# Altium project Science_Sensor_A_EM_CG - Copy.PrjPcb
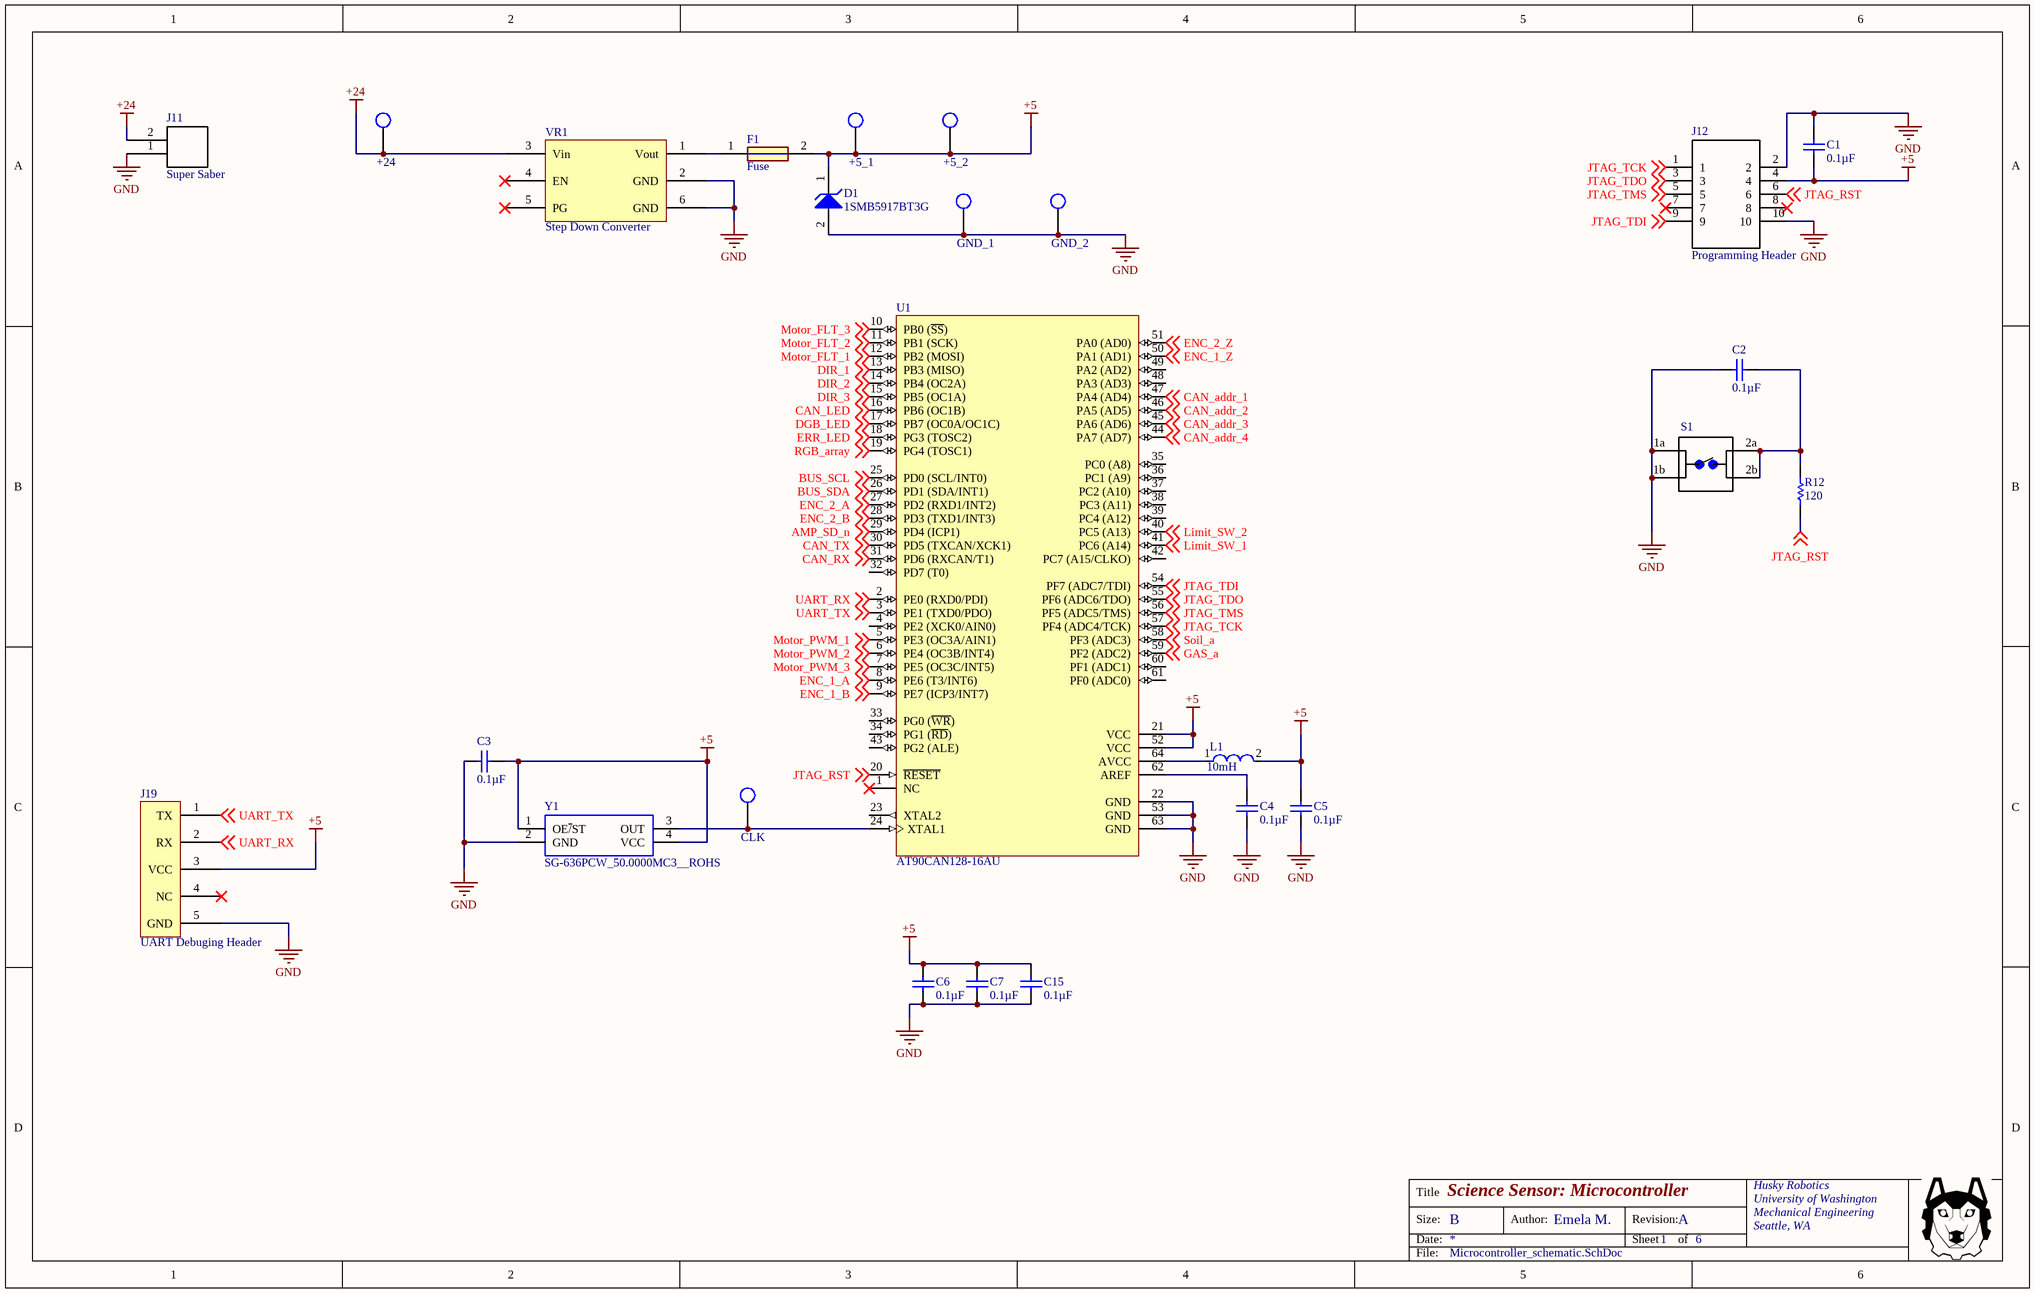
[diagram p0: Microcontroller_schematic.SchDoc]
CAGE_CODE: ?????; CONTRACT_NUMBER: <CONTRACT NO>; DOC_NO_ASSY_DWG: <ASSY DWG NO>; DOC_NO_BOM: <BOM DOC NO>; DOC_NO_FAB_DWG: <FAB DWG NO>; DOC_NO_SCH_DWG: <SCH DWG NO>; PCB_2_DEC_TOL: +/-.01; PCB_3_DEC_TOL: +/-.010; PCB_ANG_TOL: +/-1/2; PCB_ASSEMBLY_NO: <PCB ASSY NO>; PCB_CHECKER: - -----; PCB_CHECKER_APP_DATE: --/--/----; PCB_DESIGNER: - -----; PCB_DESIGNER_APP_DATE: --/--/----; PCB_DWG_NO: <PCB DWG NO>; PCB_ENGINEER: - -----; PCB_ENGINEER_APP_DATE: --/--/----; PCB_PART_NUMBER: <PCB PN>; PCB_REV: A; SCH_REV: A
6 sheets, 133 parts. Net scope: global (net labels, ports and power ports of the same name join across sheets).
Board file: Science_Sensor_A_EM_CG_PCB.PcbDoc
Sheets:
  Microcontroller_schematic.SchDoc
  Motors_and_Servos.SchDoc
  CAN.SchDoc
  LEDs.SchDoc
  Sensors.SchDoc
  Meow.SchDoc

## Sheet Microcontroller_schematic.SchDoc: Science Sensor: Microcontroller
size B; ENG_APP_DATE: --/--/--; DSN_APP_DATE: --/--/--; CHK_APP_DATE: --/--/--; Author: Emela M.; Organization: Husky Robotics; Address1: University of Washington; Address2: Mechanical Engineering; Address3: Seattle, WA; Address4: Australia 2086; Revision: A; SheetNumber: 1; SheetTotal: 6

### Parts
+5_1  Test Point  [Test Point Through-hole]  (value not drawn)
+5_2  Test Point  [Test Point Through-hole]  (value not drawn)
+24  Test Point  [Test Point Through-hole]  (value not drawn)
C1  Capacitance: 0.1µF  [Cap 0805]  (hidden comment: Capacitor 0805)
C2  Capacitance: 0.1µF  [Cap 0805]  (hidden comment: Capacitor 0805)
C3  Capacitance: 0.1µF  [Cap 0805]  (hidden comment: Capacitor 0805)
C4  Capacitance: 0.1µF  [Cap 0805]  (hidden comment: Capacitor 0805)
C5  Capacitance: 0.1µF  [Cap 0805]  (hidden comment: Capacitor 0805)
C6  Capacitance: 0.1µF  [Cap 0805]  (hidden comment: Capacitor 0805)
C7  Capacitance: 0.1µF  [Cap 0805]  (hidden comment: Capacitor 0805)
C15  Capacitance: 0.1µF  [Cap 0805]  (hidden comment: Capacitor 0805)
CLK  Test Point  [Test Point Through-hole]  (value not drawn)
D1  1SMB5917BT3G  [ONSC-SMB-2-403A-03_H_V]
F1  Fuse  [Fuse_Through_Hole - duplicate]
GND_1  Test Point  [Test Point Through-hole]  (value not drawn)
GND_2  Test Point  [Test Point Through-hole]  (value not drawn)
J11  Super Saber  [SuperSaber R/A]
J12  Programming Header  [programming3D]
J19  UART Debuging Header  [UART Debugging Header]
L1  10mH  [FP-CV201210-R10K-MFG]
R12  value 120  [RESC0805(2012)_N]  (hidden comment: Resistor 0805)
S1  1825910-7  [Switch 6mm 24V (NO)]  (value not drawn)
U1  AT90CAN128-16AU  [64A_M]
VR1  Step Down Converter  [24V-5V Converter]
Y1  SG-636PCW_50.0000MC3__ROHS  [SG-636_3D]

### Nets
+5: +5_1.1 +5_2.1 C1.1 C3.2 C5.2 C6.2 C7.2 C15.2 D1.1(K) F1.2 J12.4 J19.3(VCC) L1.2 U1.21(VCC) U1.52(VCC) Y1.1(OE~{/}ST) Y1.4(VCC)
+24: +24.1 J11.2 VR1.3(Vin)
GND: C1.2 C2.1 C3.1 C4.1 C5.1 C6.1 C7.1 C15.1 D1.2(A) GND_1.1 GND_2.1 J11.1 J12.2 J12.10 J19.5(GND) S1.1a S1.1b U1.22(GND) U1.53(GND) U1.63(GND) VR1.2(GND) VR1.6(GND) Y1.2(GND)
AMP_SD_n: U1.29(PD4_(ICP1)) ; off-sheet AMP_SD_n
BUS_SCL: U1.25(PD0_(SCL/INT0)) ; off-sheet BUS_SCL
BUS_SDA: U1.26(PD1_(SDA/INT1)) ; off-sheet BUS_SDA
CAN_addr_1: U1.47(PA4_(AD4)) ; off-sheet CAN_addr_1
CAN_addr_2: U1.46(PA5_(AD5)) ; off-sheet CAN_addr_2
CAN_addr_3: U1.45(PA6_(AD6)) ; off-sheet CAN_addr_3
CAN_addr_4: U1.44(PA7_(AD7)) ; off-sheet CAN_addr_4
CAN_LED: U1.16(PB6_(OC1B)) ; off-sheet CAN_LED
CAN_RX: U1.31(PD6_(RXCAN/T1)) ; off-sheet CAN_RX
CAN_TX: U1.30(PD5_(TXCAN/XCK1)) ; off-sheet CAN_TX
DGB_LED: U1.17(PB7_(OC0A/OC1C)) ; off-sheet DGB_LED
DIR_1: U1.13(PB3_(MISO)) ; off-sheet DIR_1
DIR_2: U1.14(PB4_(OC2A)) ; off-sheet DIR_2
DIR_3: U1.15(PB5_(OC1A)) ; off-sheet DIR_3
ENC_1_A: U1.8(PE6_(T3/INT6)) ; off-sheet ENC_1_A
ENC_1_B: U1.9(PE7_(ICP3/INT7)) ; off-sheet ENC_1_B
ENC_1_Z: U1.50(PA1_(AD1)) ; off-sheet ENC_1_Z
ENC_2_A: U1.27(PD2_(RXD1/INT2)) ; off-sheet ENC_2_A
ENC_2_B: U1.28(PD3_(TXD1/INT3)) ; off-sheet ENC_2_B
ENC_2_Z: U1.51(PA0_(AD0)) ; off-sheet ENC_2_Z
ERR_LED: U1.18(PG3_(TOSC2)) ; off-sheet ERR_LED
GAS_a: U1.59(PF2_(ADC2)) ; off-sheet GAS_a
JTAG_RST: J12.6 R12.1 U1.20(~{RESET}) ; off-sheet JTAG_RST
JTAG_TCK: J12.1 U1.57(PF4_(ADC4/TCK)) ; off-sheet JTAG_TCK
JTAG_TDI: J12.9 U1.54(PF7_(ADC7/TDI)) ; off-sheet JTAG_TDI
JTAG_TDO: J12.3 U1.55(PF6_(ADC6/TDO)) ; off-sheet JTAG_TDO
JTAG_TMS: J12.5 U1.56(PF5_(ADC5/TMS)) ; off-sheet JTAG_TMS
Limit_SW_1: U1.41(PC6_(A14)) ; off-sheet Limit_SW_1
Limit_SW_2: U1.40(PC5_(A13)) ; off-sheet Limit_SW_2
Motor_FLT_1: U1.12(PB2_(MOSI)) ; off-sheet Motor_FLT_1
Motor_FLT_2: U1.11(PB1_(SCK)) ; off-sheet Motor_FLT_2
Motor_FLT_3: U1.10(PB0_(~{SS})) ; off-sheet Motor_FLT_3
Motor_PWM_1: U1.5(PE3_(OC3A/AIN1)) ; off-sheet Motor_PWM_1
Motor_PWM_2: U1.6(PE4_(OC3B/INT4)) ; off-sheet Motor_PWM_2
Motor_PWM_3: U1.7(PE5_(OC3C/INT5)) ; off-sheet Motor_PWM_3
RGB_array: U1.19(PG4_(TOSC1)) ; off-sheet RGB_array
Soil_a: U1.58(PF3_(ADC3)) ; off-sheet Soil_a
UART_RX: J19.2(RX) U1.2(PE0_(RXD0/PDI)) ; off-sheet UART_RX
UART_TX: J19.1(TX) U1.3(PE1_(TXD0/PDO)) ; off-sheet UART_TX
NetC2_2: C2.2 R12.2 S1.2a S1.2b
NetC4_2: C4.2 U1.62(AREF)
NetCLK_1: CLK.1 U1.24(XTAL1) Y1.3(OUT)
NetF1_1: F1.1 VR1.1(Vout)
NetL1_1: L1.1 U1.64(AVCC)

Not connected (* = marked no-connect by the designer): J12 7* 8*; J19 4(NC)*; U1 1(NC)* 4(PE2_(XCK0/AIN0)) 23(XTAL2) 32(PD7_(T0)) 33(PG0_(~{WR})) 34(PG1_(~{RD})) 35(PC0_(A8)) 36(PC1_(A9)) 37(PC2_(A10)) 38(PC3_(A11)) 39(PC4_(A12)) 42(PC7_(A15/CLKO)) 43(PG2_(ALE)) 48(PA3_(AD3)) 49(PA2_(AD2)) 60(PF1_(ADC1)) 61(PF0_(ADC0)); VR1 4(EN)* 5(PG)*

### Notes on the sheet
- Title
- Size:
- Date:
- B
- Author:
- Revision:
- Sheet
- of
- File:

### Library data of the parts
C1-C7 C15 = Capacitor 0805: Standard Capacitor; Manufacturer: AVX; Tolerance (%): ±10%; Dielectric: X5R; Rated Voltage: 10V; Datasheet Version: 05/2016; Manufacturer URL: http://www.avx.com/; Package Description: 2-Pin Surface Mount Device, Body 2.01 x 1.25 mm; Mounting Technology: SurfaceMount; Case Size/Dimension: 0805; Package Reference: 0805; Datasheet URL: http://datasheets.avx.com/cx5r.pdf
D1 = Zener Diode 5.1V: 3 W Zener Voltage Regulator, 2-Pin SMB, Pb-Free, Tape and Reel; Manufacturer: On Semiconductor; VZ Typ (V): 4.7; RoHS: Pb-Free; ComponentLink1Description: Manufacturer URL; ComponentLink2URL: http://www.onsemi.com/pub_link/Collateral/1SMB5913BT3-D.PDF; Mounting Technology: Surface Mount; PackageVersion: Rev. H, 05/2011; DatasheetVersion: Rev. 8; Packing: Tape and Reel; PartNumber: 1SMB5917BT3G; ComponentLink2Description: Datasheet; ComponentLink3Description: Package Specification; PackageReference: SMB-2-403A-03_H; ComponentLink1URL: http://www.onsemi.com/; PackageDescription: 2-Pin Small Molded Package, J-Bend Lead, Body 4.33 x 3.625 mm; ComponentLink3URL: http://www.onsemi.com/pub_link/Collateral/1SMB5913BT3-D.PDF
L1 = CMP-07248-000019-1: FIXED IND 100NH 250MA 300 MOHM; Manufacturer: Bourns; Manufacturer Part Number: CV201210-R10K; Value: 0.1uH; Core Material: Ferrite; Tolerance: 10%; Test Frequency: 25MHz; Self Resonant Frequency: 235MHz; Q Factor: 20; Series Resistance: 300mΩ; Shielding: true; ComponentLink2Description: Datasheet; Ipc Land Pattern Name: CAPC200125X85; ComponentLink2URL: https://www.bourns.com/docs/product-datasheets/cv201210.pdf?sfvrsn=f7844854_5; RoHS: TRUE; Device Class L3: Fixed Inductors; Octopart: https://octopart.com/cv201210-r10k-bourns-2076708; Lead Free: Yes; Device Class L2: Inductors; Temperature: -55°C to +125°C; Height: 1.05mm; Automotive: No; Inductance: 0.1uH; Temperature Range High: +125°C; Category: Ind; Package: CV201210-R10K; Digikey Description: FIXED IND 100NH 250MA 300 MOHM; Device Class L1: Passive Components; Rms Current: 250mA; Mouser Description: Fixed Inductors .1uH 10% MULTI LAYER; Temperature Range Low: -55°C; Composition: Multilayer
R12 = Resistor 0805: Generic 0805 Resistor; Tolerance: 5 %; Case-Metric: 2012; Case-EIA: 0805; Power: 0.125 W; Technology: SMT
S1 = Switch 6mm 24V (NO): FSM4JAH=6MM TACT SWITCH, HIGH TEMP; MF: TE Connectivity; Contact_Current_Rating: 50 mA; Configuration_Pole-Throw: Single Pole - Single Throw; Package: None; Digi-Key_Part_Number: 450-1804-ND; Digi-Key_Purchase_URL: https://www.digikey.com/product-detail/en/te-connectivity-alcoswitch-switches/1825910-7/450-1804-ND/1731414?utm_source=snapeda&utm_medium=aggregator&utm_campaign=symbol; MP: 1825910-7; SnapEDA_Link: https://www.snapeda.com/parts/1825910-7/TE%20Connectivity%20ALCOSWITCH%20Switches/view-part/?ref=snap; EU_RoHS_Compliance: Compliant; TE_purchase_URL: https://www.te.com/usa-en/product-1825910-7.html?te_bu=Cor&te_type=disp&te_campaign=seda_glo_cor-seda-global-disp-prtnr-fy19-seda-model-bom-cta_sma-317_1&elqCampaignId=32493; Value: *
U1 = CMP-0096-00104-2: 8-bit AVR Microcontroller, 128KB Flash and CAN Controller, 53 GPIO pins, Industrial Grade (-40° to +85°C), 64-pin LQFP, Green; PackageVersion: revC, Oct-2010; ComponentLink1Description: Manufacturer URL; ComponentLink3Description: AT90CAN32/64/128 Summary; ComponentLink2Description: AT90CAN32/64/128 Datasheet; Code_JEDEC: MS-026-AEB; DatasheetVersion: revH, Aug-2008; ComponentLink2URL: http://www.atmel.com/dyn/resources/prod_documents/doc7679.pdf; ComponentLink3URL: http://www.atmel.com/dyn/resources/prod_documents/7679S.pdf; ComponentLink1URL: http://www.atmel.com/; RevisionNote: PackageVersion updated. URLs added.; PackageReference: 64A; PackageDescription: 64-Pin Plastic Thin Profile Quad Flat Pack, 14 x 14 x 1.0 mm Body, 0.8 mm Pitch (TQFP)
VR1 = 24V-5V Pololu 2858
Y1 = Oscilator: Standard Clock Oscillators; Manufacturer_Name: Epson Timing; Manufacturer_Part_Number: SG-636PCW 50.0000MC3: ROHS; RS Part Number: *; RS Price/Stock: *; Arrow Part Number: SG-636PCW 50.0000MC3: ROHS; Arrow Price/Stock: *; Datasheet Link: http://www.mouser.com/ds/2/137/G-636PCE_en-1003252.pdf

## Sheet Motors_and_Servos.SchDoc: Science Sensor: Motors & Servos
size Letter; Author: Emela M.; Organization: Husky Robotics; Address1: University of Washington; Address2: Mechanical Engineering; Address3: Seattle, WA; Revision: A; SheetNumber: 2; SheetTotal: 6
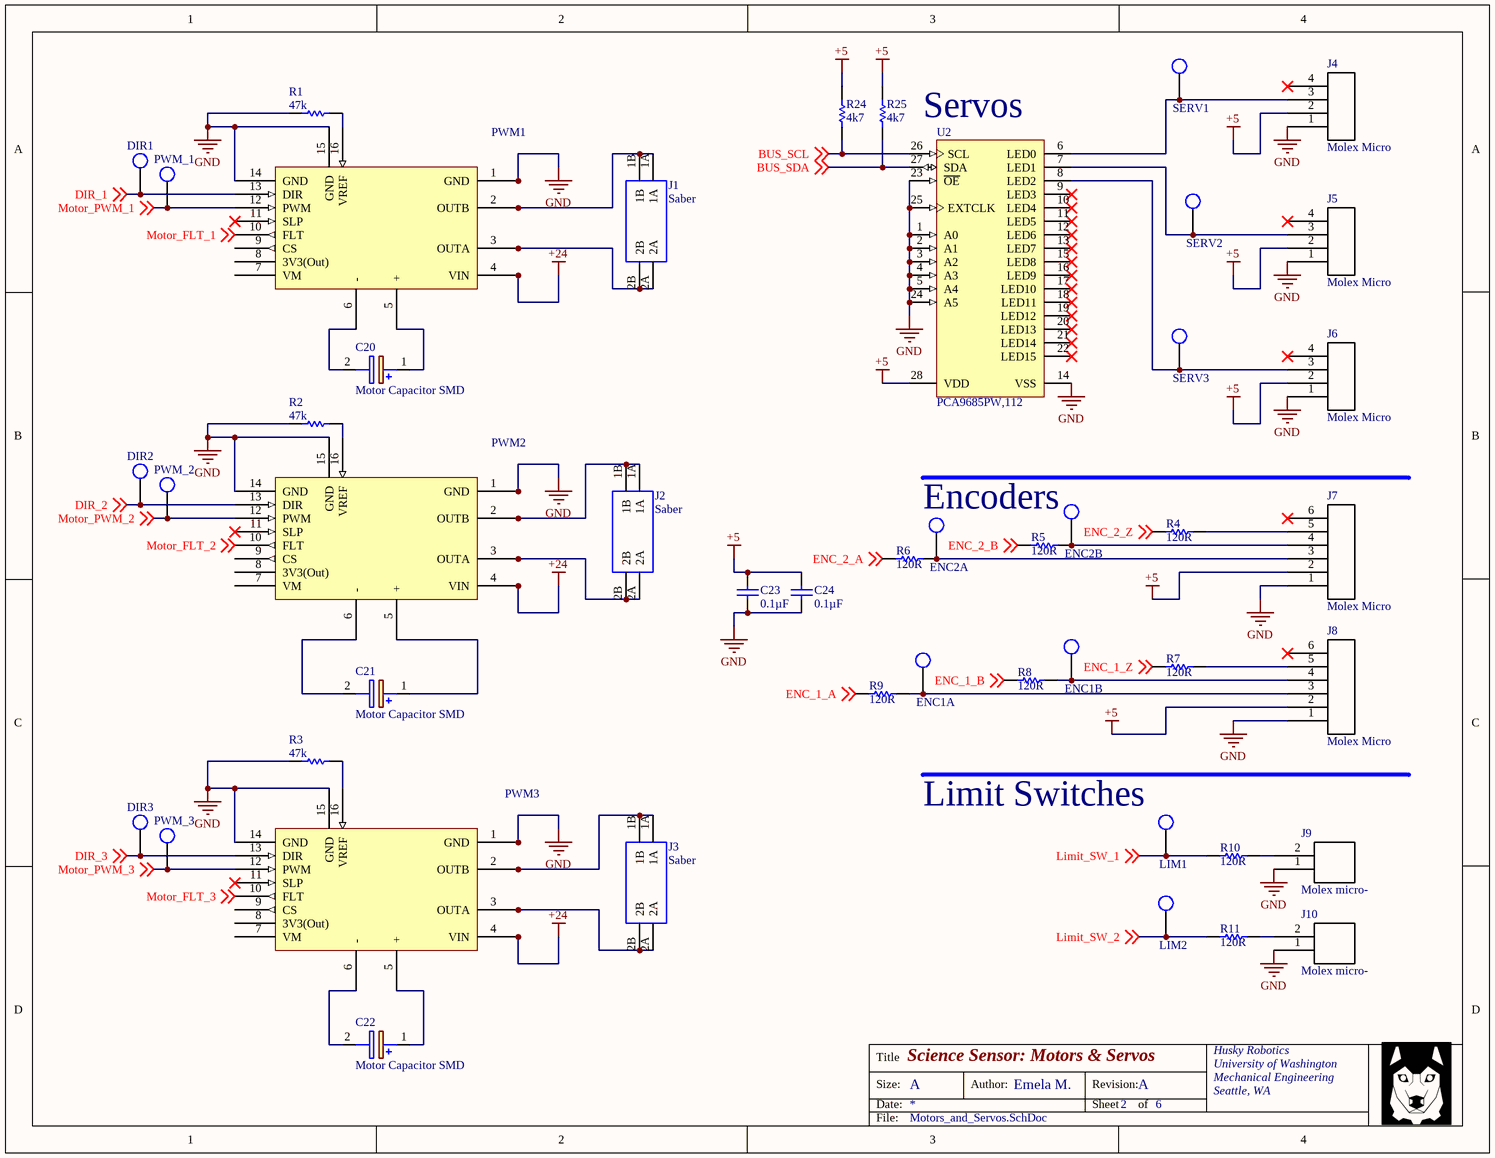
[diagram p1: Motors_and_Servos.SchDoc]

### Parts
C20  Motor Capacitor SMD  [CAP_SMD_CAN]
C21  Motor Capacitor SMD  [CAP_SMD_CAN]
C22  Motor Capacitor SMD  [CAP_SMD_CAN]
C23  Capacitance: 0.1µF  [Cap 0805]  (hidden comment: Capacitor 0805)
C24  Capacitance: 0.1µF  [Cap 0805]  (hidden comment: Capacitor 0805)
DIR1  Test Point  [Test Point Through-hole]  (value not drawn)
DIR2  Test Point  [Test Point Through-hole]  (value not drawn)
DIR3  Test Point  [Test Point Through-hole]  (value not drawn)
ENC1A  Test Point  [Test Point Through-hole]  (value not drawn)
ENC1B  Test Point  [Test Point Through-hole]  (value not drawn)
ENC2A  Test Point  [Test Point Through-hole]  (value not drawn)
ENC2B  Test Point  [Test Point Through-hole]  (value not drawn)
J1  Saber  [SABER R/A]
J2  Saber  [SABER R/A]
J3  Saber  [SABER R/A]
J4  Molex Micro  [MICROFIT R/A 4 PIN]
J5  Molex Micro  [MICROFIT R/A 4 PIN]
J6  Molex Micro  [MICROFIT R/A 4 PIN]
J7  Molex Micro  [MICROFIT R/A 6 PIN]
J8  Molex Micro  [MICROFIT R/A 6 PIN]
J9  Molex micro-  [microfit R/A 2 pin]
J10  Molex micro-  [microfit R/A 2 pin]
LIM1  Test Point  [Test Point Through-hole]  (value not drawn)
LIM2  Test Point  [Test Point Through-hole]  (value not drawn)
PWM1  6.5V - 40V  [Pololu_G2_Driver_24v21]  (value not drawn)
PWM2  6.5V - 40V  [Pololu_G2_Driver_24v21]  (value not drawn)
PWM3  6.5V - 40V  [Pololu_G2_Driver_24v21]  (value not drawn)
PWM_1  Test Point  [Test Point Through-hole]  (value not drawn)
PWM_2  Test Point  [Test Point Through-hole]  (value not drawn)
PWM_3  Test Point  [Test Point Through-hole]  (value not drawn)
R1  value 47k  [RESC0805(2012)_N]  (hidden comment: Resistor 0805)
R2  value 47k  [RESC0805(2012)_N]  (hidden comment: Resistor 0805)
R3  value 47k  [RESC0805(2012)_N]  (hidden comment: Resistor 0805)
R4  value 120R  [RESC0805(2012)_N]  (hidden comment: Resistor 0805)
R5  value 120R  [RESC0805(2012)_N]  (hidden comment: Resistor 0805)
R6  value 120R  [RESC0805(2012)_N]  (hidden comment: Resistor 0805)
R7  value 120R  [RESC0805(2012)_N]  (hidden comment: Resistor 0805)
R8  value 120R  [RESC0805(2012)_N]  (hidden comment: Resistor 0805)
R9  value 120R  [RESC0805(2012)_N]  (hidden comment: Resistor 0805)
R10  value 120R  [RESC0805(2012)_N]  (hidden comment: Resistor 0805)
R11  value 120R  [RESC0805(2012)_N]  (hidden comment: Resistor 0805)
R24  value 4k7  [RESC0805(2012)_N]  (hidden comment: Resistor 0805)
R25  value 4k7  [RESC0805(2012)_N]  (hidden comment: Resistor 0805)
SERV1  Test Point  [Test Point Through-hole]  (value not drawn)
SERV2  Test Point  [Test Point Through-hole]  (value not drawn)
SERV3  Test Point  [Test Point Through-hole]  (value not drawn)
U2  PCA9685PW,112  [SOT361-1_V]

### Nets
+5: C23.2 C24.2 J4.2 J5.2 J6.2 J7.2 J8.2 R24.2 R25.2 U2.28(VDD)
+24: PWM1.4(VIN) PWM1.4a(VIN) PWM1.4b(VIN) PWM2.4(VIN) PWM2.4a(VIN) PWM2.4b(VIN) PWM3.4(VIN) PWM3.4a(VIN) PWM3.4b(VIN)
GND: C23.1 C24.1 J4.1 J5.1 J6.1 J7.1 J8.1 J9.1 J10.1 PWM1.1(GND) PWM1.1a(GND) PWM1.1b(GND) PWM1.14(GND) PWM1.15(GND) PWM2.1(GND) PWM2.1a(GND) PWM2.1b(GND) PWM2.14(GND) PWM2.15(GND) PWM3.1(GND) PWM3.1a(GND) PWM3.1b(GND) PWM3.14(GND) PWM3.15(GND) R1.2 R2.2 R3.2 U2.1(A0) U2.2(A1) U2.3(A2) U2.4(A3) U2.5(A4) U2.14(VSS) U2.23(~{OE}) U2.24(A5) U2.25(EXTCLK)
BUS_SCL: R24.1 U2.26(SCL) ; off-sheet BUS_SCL
BUS_SDA: R25.1 U2.27(SDA) ; off-sheet BUS_SDA
DIR_1: DIR1.1 PWM1.13(DIR) ; off-sheet DIR_1
DIR_2: DIR2.1 PWM2.13(DIR) ; off-sheet DIR_2
DIR_3: DIR3.1 PWM3.13(DIR) ; off-sheet DIR_3
ENC_1_A: R9.1 ; off-sheet ENC_1_A
ENC_1_B: R8.1 ; off-sheet ENC_1_B
ENC_1_Z: R7.1 ; off-sheet ENC_1_Z
ENC_2_A: R6.1 ; off-sheet ENC_2_A
ENC_2_B: R5.1 ; off-sheet ENC_2_B
ENC_2_Z: R4.1 ; off-sheet ENC_2_Z
Limit_SW_1: LIM1.1 R10.1 ; off-sheet Limit_SW_1
Limit_SW_2: LIM2.1 R11.1 ; off-sheet Limit_SW_2
Motor_FLT_1: PWM1.10(FLT) ; off-sheet Motor_FLT_1
Motor_FLT_2: PWM2.10(FLT) ; off-sheet Motor_FLT_2
Motor_FLT_3: PWM3.10(FLT) ; off-sheet Motor_FLT_3
Motor_PWM_1: PWM1.12(PWM) PWM_1.1 ; off-sheet Motor_PWM_1
Motor_PWM_2: PWM2.12(PWM) PWM_2.1 ; off-sheet Motor_PWM_2
Motor_PWM_3: PWM3.12(PWM) PWM_3.1 ; off-sheet Motor_PWM_3
NetC20_1: C20.1(+) PWM1.5(+)
NetC20_2: C20.2(-) PWM1.6(-)
NetC21_1: C21.1(+) PWM2.5(+)
NetC21_2: C21.2(-) PWM2.6(-)
NetC22_1: C22.1(+) PWM3.5(+)
NetC22_2: C22.2(-) PWM3.6(-)
NetENC1A_1: ENC1A.1 J8.3 R9.2
NetENC1B_1: ENC1B.1 J8.4 R8.2
NetENC2A_1: ENC2A.1 J7.3 R6.2
NetENC2B_1: ENC2B.1 J7.4 R5.2
NetJ1_1A: J1.1A J1.1B PWM1.2(OUTB) PWM1.2a(OUTB) PWM1.2b(OUTB)
NetJ1_2A: J1.2A J1.2B PWM1.3(OUTA) PWM1.3a(OUTA) PWM1.3b(OUTA)
NetJ2_1A: J2.1A J2.1B PWM2.2(OUTB) PWM2.2a(OUTB) PWM2.2b(OUTB)
NetJ2_2A: J2.2A J2.2B PWM2.3(OUTA) PWM2.3a(OUTA) PWM2.3b(OUTA)
NetJ3_1A: J3.1A J3.1B PWM3.2(OUTB) PWM3.2a(OUTB) PWM3.2b(OUTB)
NetJ3_2A: J3.2A J3.2B PWM3.3(OUTA) PWM3.3a(OUTA) PWM3.3b(OUTA)
NetJ4_3: J4.3 SERV1.1 U2.6(LED0)
NetJ5_3: J5.3 SERV2.1 U2.7(LED1)
NetJ6_3: J6.3 SERV3.1 U2.8(LED2)
NetJ7_5: J7.5 R4.2
NetJ8_5: J8.5 R7.2
NetJ9_2: J9.2 R10.2
NetJ10_2: J10.2 R11.2
NetPWM1_16: PWM1.16(VREF) R1.1
NetPWM2_16: PWM2.16(VREF) R2.1
NetPWM3_16: PWM3.16(VREF) R3.1

Not connected (* = marked no-connect by the designer): J4 4*; J5 4*; J6 4*; J7 6*; J8 6*; PWM1 7(VM) 8(3V3(Out)) 9(CS) 11(SLP)*; PWM2 7(VM) 8(3V3(Out)) 9(CS) 11(SLP)*; PWM3 7(VM) 8(3V3(Out)) 9(CS) 11(SLP)*; U2 9(LED3)* 10(LED4)* 11(LED5)* 12(LED6)* 13(LED7)* 15(LED8)* 16(LED9)* 17(LED10)* 18(LED11)* 19(LED12)* 20(LED13)* 21(LED14)* 22(LED15)*

### Notes on the sheet
- Servos
- (near ENC2B) Encoders
- (near LIM1) Limit Switches
- Title
- Size:
- Date:
- A
- Author:
- Revision:
- Sheet
- of
- File:

### Library data of the parts
C20-C22 = Motor Capacitor SMD: Capacitor Polarised; Manufacturer_Name: Panasonic; Manufacturer_Part_Number: EEE-FK1V331AP; Datasheet Link: https://www.arrow.com/en/products/eee-fk1v331ap/panasonic; Height: 10.5mm; Arrow Part Number: EEE-FK1V331AP; Arrow Price/Stock: https://www.arrow.com/en/products/eee-fk1v331ap/panasonic; Mouser Part Number: 667-EEE-FK1V331AP; Mouser Price/Stock: http://www.mouser.com/Search/ProductDetail.aspx?qs=fgLb7gR0z4waT8A8J1cE1w%3d%3d
C23 C24 = Capacitor 0805: as C1 on sheet Microcontroller_schematic; Datasheet Version: 05/2016; Manufacturer URL: http://www.avx.com/; Package Description: 2-Pin Surface Mount Device, Body 2.01 x 1.25 mm; Mounting Technology: SurfaceMount; Case Size/Dimension: 0805; Package Reference: 0805; Datasheet URL: http://datasheets.avx.com/cx5r.pdf
J4-J6 = Molex micro-fit 4-pin (Single row schematic): Molex micro-fit 3.0 dual row header. P/N 0430450427
J7 J8 = Molex micro-fit 6-pin (single row schematic): Molex micro-fit 3.0 dual row connector. P/N 0430450627
J9 J10 = Molex micro-fit 2-pin: Molex micro-fit 3.0. Molex P/N 0430450227
PWM1-PWM3 = Pololu G2 High-Power Motor Driver 24v21: This discrete MOSFET H-bridge motor driver enables bidirectional control of one high-power DC brushed motor. The small 1.3″ × 0.8″ board supports a wide 6.5 V to 40 V voltage range and is efficient enough to deliver a continuous 21 A without a heat sink. Additional features of this second-generation (G2) driver include reverse-voltage protection along with basic current sensing and current limiting functionality.; ComponentLink1Description: Product Info; ComponentLink1URL: https://www.pololu.com/product/2995/specs
R1-R11 R24 R25 = Resistor 0805: as R12 on sheet Microcontroller_schematic; Technology: SMT
U2 = CMP-1595-00004-2: 16-Channel, 12-Bit PWM Fm+ I2C-Bus LED Controller, 2.3 to 5.5 V, -40 to 85 degC, 28-Pin TSSOP (SOT361-1), RoHS, Tape and Reel; Supply Current Max: 10 mA; Supply Voltage Min: 2.3 V; Supply Voltage Max: 5.5 V; Frequency: 25000000 Hz; Temperature Min: -40 degC; PackageDescription: 28-Pin Small Outline Package, Body 9.7 x 4.4 mm, Pitch 0.65 mm; RoHS: TRUE; ComponentLink1Description: Manufacturer URL; Code_JEDEC: MO-153; PartNumber: PCA9685; ComponentLink2URL: http://www.nxp.com/documents/data_sheet/PCA9685.pdf; Packing: Tape and Reel; ComponentLink1URL: http://www.nxp.com/; ComponentLink3Description: Package Specification; ComponentLink2Description: Datasheet; ComponentLink3URL: http://www.nxp.com/documents/outline_drawing/sot361-1_po.pdf; DatasheetVersion: Rev. 4; Temperature Max: 85 degC; PackageVersion: 02/2003; Mounting Technology: Surface Mount

## Sheet CAN.SchDoc: Science Sensor: CAN
size Letter; Author: Emela M.; Organization: Husky Robotics; Address1: University of Washington; Address2: Mechanical Engineering; Address3: Seattle, WA; Revision: A; SheetNumber: 3; SheetTotal: 6
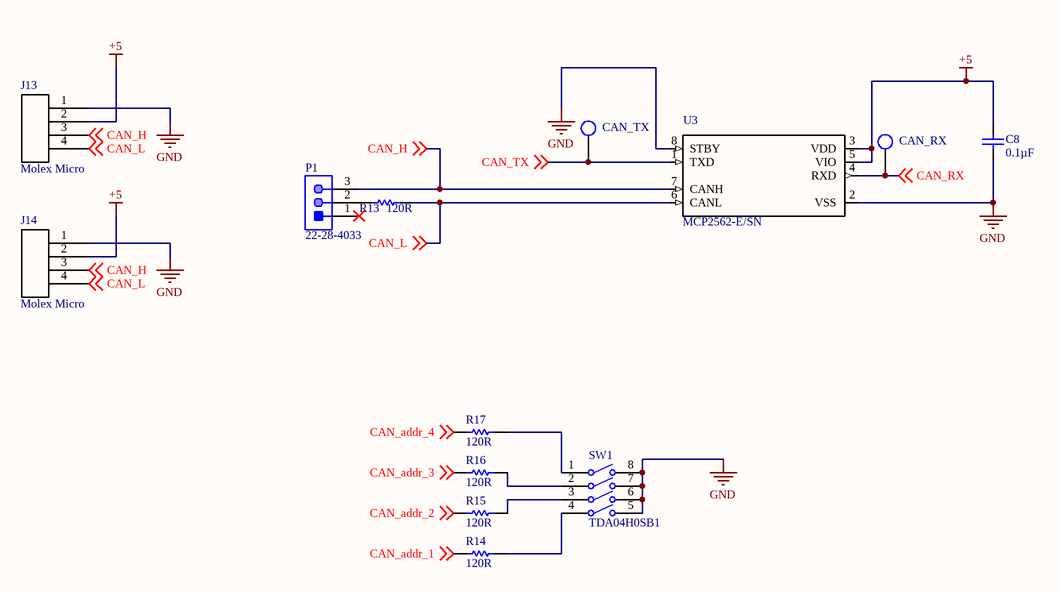
[diagram p2: CAN.SchDoc]

### Parts
C8  Capacitance: 0.1µF  [Cap 0805]  (hidden comment: Capacitor 0805)
CAN_RX  Test Point  [Test Point Through-hole]  (value not drawn)
CAN_TX  Test Point  [Test Point Through-hole]  (value not drawn)
J13  Molex Micro  [MICROFIT R/A 4 PIN]
J14  Molex Micro  [MICROFIT R/A 4 PIN]
P1  22-28-4033  [MOLX-22-28-4033_V]
R13  value 120R  [RESC0805(2012)_N]  (hidden comment: Resistor 0805)
R14  value 120R  [RESC0805(2012)_N]  (hidden comment: Resistor 0805)
R15  value 120R  [RESC0805(2012)_N]  (hidden comment: Resistor 0805)
R16  value 120R  [RESC0805(2012)_N]  (hidden comment: Resistor 0805)
R17  value 120R  [RESC0805(2012)_N]  (hidden comment: Resistor 0805)
SW1  TDA04H0SB1  [CKCP-TDA04H0SB1R_V]
U3  MCP2562-E/SN  [SOIC127P600X175-8N]

### Nets
+5: C8.2 J13.2 J14.2 U3.3(VDD) U3.5(VIO)
GND: C8.1 J13.1 J14.1 SW1.5 SW1.6 SW1.7 SW1.8 U3.2(VSS) U3.8(STBY)
CAN_addr_1: R14.1 ; off-sheet CAN_addr_1
CAN_addr_2: R15.1 ; off-sheet CAN_addr_2
CAN_addr_3: R16.1 ; off-sheet CAN_addr_3
CAN_addr_4: R17.1 ; off-sheet CAN_addr_4
CAN_H: J13.3 J14.3 P1.3 U3.7(CANH) ; off-sheet CAN_H
CAN_L: J13.4 J14.4 R13.2 U3.6(CANL) ; off-sheet CAN_L
CAN_RX: CAN_RX.1 U3.4(RXD) ; off-sheet CAN_RX
CAN_TX: CAN_TX.1 U3.1(TXD) ; off-sheet CAN_TX
NetP1_2: P1.2 R13.1
NetR14_2: R14.2 SW1.4
NetR15_2: R15.2 SW1.3
NetR16_2: R16.2 SW1.2
NetR17_2: R17.2 SW1.1

Not connected (* = marked no-connect by the designer): P1 1*

### Notes on the sheet
- Title
- Size:
- Date:
- A
- Author:
- Revision:
- Sheet
- of
- File:

### Library data of the parts
C8 = Capacitor 0805: as C1 on sheet Microcontroller_schematic; Datasheet Version: 05/2016; Manufacturer URL: http://www.avx.com/; Package Description: 2-Pin Surface Mount Device, Body 2.01 x 1.25 mm; Mounting Technology: SurfaceMount; Case Size/Dimension: 0805; Package Reference: 0805; Datasheet URL: http://datasheets.avx.com/cx5r.pdf
J13 J14 = Molex micro-fit 4-pin (Single row schematic): as J4 on sheet Motors_and_Servos
P1 = CMP-1676-00001-5: Male Header, Pitch 2.54 mm, 1 x 3 Position, Height 8.38 mm, Tail Length 3.18 mm, RoHS, Bulk; Manufacturer: Molex; Rows: 1; Voltage Rating: 250 V; Current Rating: 4 A; Min Operating Temperature: 0 degC; Lead Pitch: 0.1 inch; Packaging: Bulk; Contact Finish: Gold; RoHSCompliant: true; Contact Material: Brass; PackageReference: 22-28-4033; REACH SVHC: Unknown; PackageDescription: Male Header, Pitch 2.54 mm, 1 x 3 Position, Height 8.38 mm, Tail Length 3.18 mm; ComponentLink2URL: http://www.molex.com/pdm_docs/sd/022284033_sd.pdf; Height: 8.38 mm; Mounting Technology: Through Hole; ComponentLink1Description: Manufacturer URL; Length: 7.62 mm; Mount: Through Hole; DatasheetVersion: Rev. G, 01/2012; Max Operating Temperature: 75 degC; ComponentLink2Description: Datasheet; Colour: Black; Pins: 3; Contact Plating: Gold; Package Quantity: 1; ComponentLink1URL: http://www.molex.com/
R13-R17 = Resistor 0805: as R12 on sheet Microcontroller_schematic; Technology: SMT
SW1 = Dip Switch Array SMD Half-Pitch: Ultra-Miniature Surface Mount Half-Pitch DIP Switch, 25 mA, 24 V, -40 to 85 degC, 8-Pin SMD, RoHS, Tube; Contact Current Rating: 100 mA; Throw Configuration: SPST; Voltage Rating (DC): 24 V; Max Contact Resistance: 100 mohm; Max Current Rating: 25 mA; REACH SVHC: No SVHC; DatasheetVersion: 02/2016; Case\Package: DIP; Package Quantity: 70; Lead Pitch: 1.27 mm; Contact Plating: Gold; Packaging: Rail/Tube; Contact Finish: Gold; Mount: Surface Mount; Height: 2.3 mm; Contact Material: Copper; Max Operating Temperature: 85 degC; Max Voltage Rating (DC): 24 V; ComponentLink1URL: https://www.ckswitches.com/media/1328/tda.pdf; PackageDescription: 8-Pin Surface Mount Device, Body 6.21 x 6.2 mm, Pitch 1.27 mm; Radiation Hardening: No; ComponentLink1Description: Datasheet Link; Current Rating: 100 mA; RoHSCompliant: true; PackageReference: TDA04H0SB1R; Min Operating Temperature: -40 degC; Pins: 4; Mounting Technology: Surface Mount; Length: 6.21 mm; Digi-Key_Part_Number: CKN9065-ND; ComponentLink2Description: Digi-Key_Purchase_URL; ComponentLink2URL: https://www.digikey.com/en/products/detail/c-k/TDA04H0SB1/1083755
U3 = CAN Tranceiver: Microchip MCP2562-E/SN, CAN Transceiver 1MBps 1-channel IEC 61000-4-2, 8-Pin SOIC; Price: None; MF: Microchip; SnapEDA_Link: https://www.snapeda.com/parts/MCP2562-E/SN/Microchip/view-part/?ref=snap; MP: MCP2562-E/SN; Availability: Unavailable; Package: SO-8 Microchip; Value: *

## Sheet LEDs.SchDoc: Science Sensor: LEDs
size Letter; Author: Emela M.; Organization: Husky Robotics; Address1: University of Washington; Address2: Mechanical Engineering; Address3: Seattle, WA; Revision: A; SheetNumber: 4; SheetTotal: 6
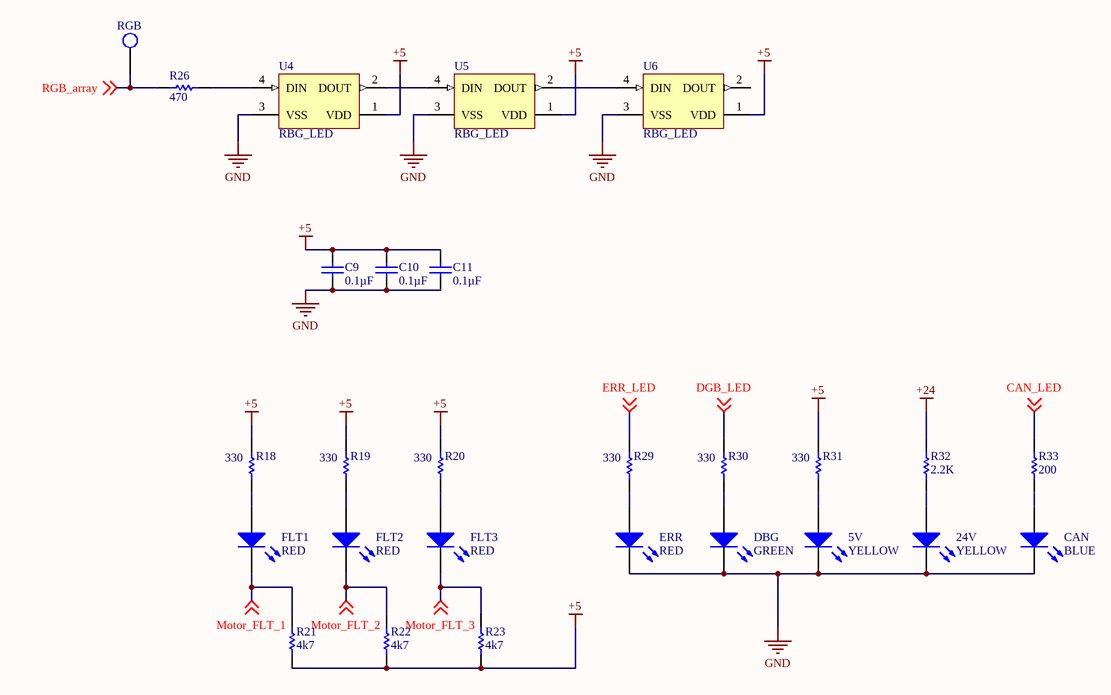
[diagram p3: LEDs.SchDoc]

### Parts
5V  YELLOW  [0805_A]
24V  YELLOW  [0805_A]
C9  Capacitance: 0.1µF  [Cap 0805]  (hidden comment: Capacitor 0805)
C10  Capacitance: 0.1µF  [Cap 0805]  (hidden comment: Capacitor 0805)
C11  Capacitance: 0.1µF  [Cap 0805]  (hidden comment: Capacitor 0805)
CAN  BLUE  [0805_A]
DBG  GREEN  [0805_A]
ERR  RED  [0805_A]
FLT1  RED  [0805_A]
FLT2  RED  [0805_A]
FLT3  RED  [0805_A]
R18  330  [RESC0805(2012)_N]
R19  330  [RESC0805(2012)_N]
R20  330  [RESC0805(2012)_N]
R21  4k7  [RESC0805(2012)_N]
R22  4k7  [RESC0805(2012)_N]
R23  4k7  [RESC0805(2012)_N]
R26  value 470  [RESC0805(2012)_N]  (hidden comment: Resistor 0805)
R29  330  [RESC0805(2012)_N]
R30  330  [RESC0805(2012)_N]
R31  330  [RESC0805(2012)_N]
R32  2.2K  [RESC0805(2012)_N]
R33  200  [RESC0805(2012)_N]
RGB  Test Point  [Test Point Through-hole]  (value not drawn)
U4  RBG_LED  [RGB_LED_1]
U5  RBG_LED  [RGB_LED_1]
U6  RBG_LED  [RGB_LED_1]

### Nets
+5: C9.2 C10.2 C11.2 R18.2 R19.2 R20.2 R21.1 R22.1 R23.1 R31.2 U4.1(VDD) U5.1(VDD) U6.1(VDD)
+24: R32.2
GND: 5V.1(K) 24V.1(K) C9.1 C10.1 C11.1 CAN.1(K) DBG.1(K) ERR.1(K) U4.3(VSS) U5.3(VSS) U6.3(VSS)
CAN_LED: R33.2 ; off-sheet CAN_LED
DGB_LED: R30.2 ; off-sheet DGB_LED
ERR_LED: R29.2 ; off-sheet ERR_LED
Motor_FLT_1: FLT1.1(K) R21.2 ; off-sheet Motor_FLT_1
Motor_FLT_2: FLT2.1(K) R22.2 ; off-sheet Motor_FLT_2
Motor_FLT_3: FLT3.1(K) R23.2 ; off-sheet Motor_FLT_3
RGB_array: R26.1 RGB.1 ; off-sheet RGB_array
Net5V_2: 5V.2(A) R31.1
Net24V_2: 24V.2(A) R32.1
NetCAN_2: CAN.2(A) R33.1
NetDBG_2: DBG.2(A) R30.1
NetERR_2: ERR.2(A) R29.1
NetFLT1_2: FLT1.2(A) R18.1
NetFLT2_2: FLT2.2(A) R19.1
NetFLT3_2: FLT3.2(A) R20.1
NetR26_2: R26.2 U4.4(DIN)
NetU4_2: U4.2(DOUT) U5.4(DIN)
NetU5_2: U5.2(DOUT) U6.4(DIN)

Not connected (* = marked no-connect by the designer): U6 2(DOUT)

### Notes on the sheet
- Title
- Size:
- Date:
- A
- Author:
- Revision:
- Sheet
- of
- File:

### Library data of the parts
5V 24V CAN DBG ERR FLT1-FLT3 = LED: Standard 0805 LED; Manufacturer: Wuerth Elektronik; PartNumber: 150080SS75000; PackageReference: 0805_A; ComponentLink2URL: http://katalog.we-online.com/led/datasheet/150080SS75000.pdf; ComponentLink1URL: http://www.we-online.com; Color: Super Red; ComponentLink2Description: Datasheet; ComponentLink1Description: Manufacturer URL
C9-C11 = Capacitor 0805: as C1 on sheet Microcontroller_schematic; Datasheet Version: 05/2016; Manufacturer URL: http://www.avx.com/; Package Description: 2-Pin Surface Mount Device, Body 2.01 x 1.25 mm; Mounting Technology: SurfaceMount; Case Size/Dimension: 0805; Package Reference: 0805; Datasheet URL: http://datasheets.avx.com/cx5r.pdf
R18-R20 R26 R29-R31 = Resistor 0805: as R12 on sheet Microcontroller_schematic; Technology: SMT
  R18-R20 R29-R31: Value: 330
R21-R23 R32 R33 = Resistor 0805: Generic 0805 Resistor; Tolerance: 5 %; Case-Metric: 2012; Value: 120R; Case-EIA: 0805; Power: 0.125 W; Technology: SMT
U4-U6 = RBG_LED: LED ADAI-WS2812B-4

## Sheet Sensors.SchDoc: Science Sensor: Sensors
size Letter; Author: Emela M.; Organization: Husky Robotics; Address1: University of Washington; Address2: Mechanical Engineering; Address3: Seattle, WA; Revision: A; SheetNumber: 5; SheetTotal: 6
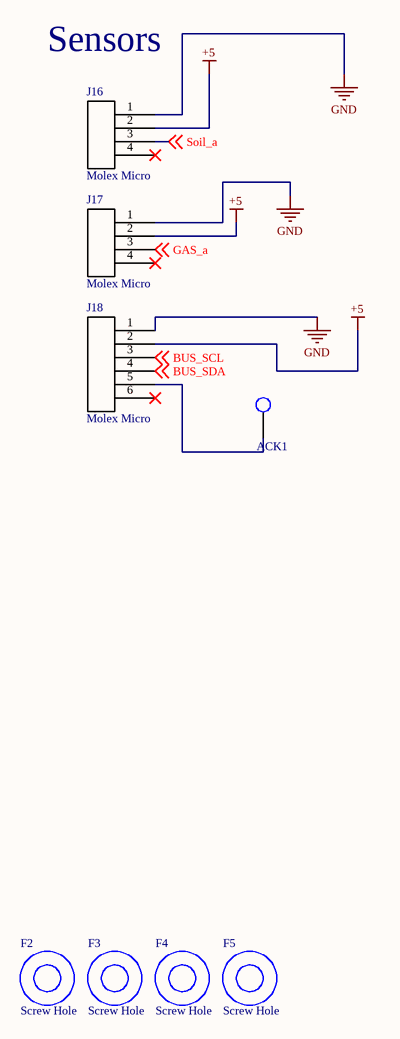
[diagram p4: Sensors.SchDoc]

### Parts
ACK1  Test Point  [Test Point Through-hole]  (value not drawn)
F2  Screw Hole  [Screw Hole]
F3  Screw Hole  [Screw Hole]
F4  Screw Hole  [Screw Hole]
F5  Screw Hole  [Screw Hole]
J16  Molex Micro  [MICROFIT R/A 4 PIN]
J17  Molex Micro  [MICROFIT R/A 4 PIN]
J18  Molex Micro  [MICROFIT R/A 6 PIN]

### Nets
+5: J16.2 J17.2 J18.2
GND: J16.1 J17.1 J18.1
BUS_SCL: J18.3 ; off-sheet BUS_SCL
BUS_SDA: J18.4 ; off-sheet BUS_SDA
GAS_a: J17.3 ; off-sheet GAS_a
Soil_a: J16.3 ; off-sheet Soil_a
NetACK1_1: ACK1.1 J18.5

Not connected (* = marked no-connect by the designer): J16 4*; J17 4*; J18 6*

### Notes on the sheet
- Sensors
- Title
- Size:
- Date:
- A
- Author:
- Revision:
- Sheet
- of
- File:

### Library data of the parts
F2-F5 = Screw Hole: Add 4 of these to your design for screw hole mounting
J16 J17 = Molex micro-fit 4-pin (Single row schematic): as J4 on sheet Motors_and_Servos
J18 = Molex micro-fit 6-pin (single row schematic): as J7 on sheet Motors_and_Servos

## Sheet Meow.SchDoc: Science Sensor: Meow
size Letter; Author: Emela M.; Organization: Husky Robotics; Address1: University of Washington; Address2: Mechanical Engineering; Address3: Seattle, WA; Revision: A; SheetNumber: 6; SheetTotal: 6
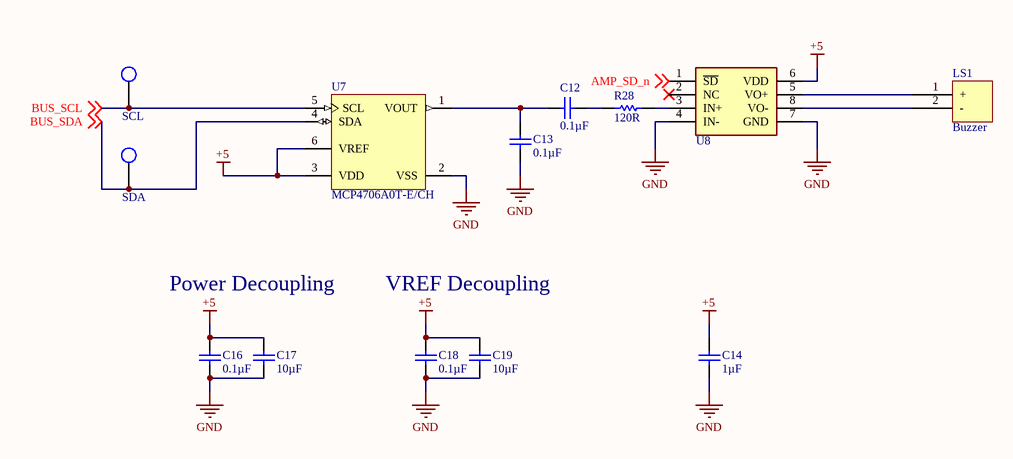
[diagram p5: Meow.SchDoc]

### Parts
C12  Capacitance: 0.1µF  [Cap 0805]  (hidden comment: Capacitor 0805)
C13  Capacitance: 0.1µF  [Cap 0805]  (hidden comment: Capacitor 0805)
C14  Capacitance: 1µF  [Cap 0805]  (hidden comment: Capacitor 0805)
C16  Capacitance: 0.1µF  [Cap 0805]  (hidden comment: Capacitor 0805)
C17  Capacitance: 10µF  [Cap 0805]  (hidden comment: Capacitor 0805)
C18  Capacitance: 0.1µF  [Cap 0805]  (hidden comment: Capacitor 0805)
C19  Capacitance: 10µF  [Cap 0805]  (hidden comment: Capacitor 0805)
LS1  Buzzer  [Buzzer]
R28  value 120R  [RESC0805(2012)_N]  (hidden comment: Resistor 0805)
SCL  Test Point  [Test Point Through-hole]  (value not drawn)
SDA  Test Point  [Test Point Through-hole]  (value not drawn)
U7  MCP4706A0T-E/CH  [SOT-23-CH6_M]
U8  Amplifier  [Amplifier]  (value not drawn)

### Nets
+5: C14.2 C16.2 C17.1 C18.2 C19.2 U7.3(VDD) U7.6(VREF) U8.6(VDD)
GND: C13.1 C14.1 C16.1 C17.2 C18.1 C19.1 U7.2(VSS) U8.4(IN-) U8.7(GND)
AMP_SD_n: U8.1(~{SD}) ; off-sheet AMP_SD_n
BUS_SCL: SCL.1 U7.5(SCL) ; off-sheet BUS_SCL
BUS_SDA: SDA.1 U7.4(SDA) ; off-sheet BUS_SDA
NetC12_1: C12.1 C13.2 U7.1(VOUT)
NetC12_2: C12.2 R28.2
NetLS1_1: LS1.1(+) U8.5(VO+)
NetLS1_2: LS1.2(-) U8.8(VO-)
NetR28_1: R28.1 U8.3(IN+)

Not connected (* = marked no-connect by the designer): U8 2(NC)*

### Notes on the sheet
- Power Decoupling
- VREF Decoupling
- Title
- Size:
- Date:
- A
- Author:
- Revision:
- Sheet
- of
- File:

### Library data of the parts
C12-C14 C16-C19 = Capacitor 0805: as C1 on sheet Microcontroller_schematic; Datasheet Version: 05/2016; Manufacturer URL: http://www.avx.com/; Package Description: 2-Pin Surface Mount Device, Body 2.01 x 1.25 mm; Mounting Technology: SurfaceMount; Case Size/Dimension: 0805; Package Reference: 0805; Datasheet URL: http://datasheets.avx.com/cx5r.pdf
LS1 = Buzzer: PK-21N30PQ
R28 = Resistor 0805: as R12 on sheet Microcontroller_schematic; Technology: SMT
U7 = CMP-0188-01198-1: 8-Bit Voltage Output Digital-to-Analog Converter with EEPROM and I2C Interface, 6-Pin SOT-23, Extended Temperature, Tape and Reel; PackageReference: SOT-23-CH6; Code_IPC: SOT26A-6; ComponentLink3URL: http://www.microchip.com/stellent/groups/techpub_sg/documents/packagingspec/en012702.pdf; ComponentLink1URL: http://www.microchip.com/; ComponentLink2URL: http://ww1.microchip.com/downloads/en/DeviceDoc/22272B.pdf; PackageDescription: 6-Lead Plastic Small Outline Transistor (CH) [SOT-23]; PackageVersion: revBB, Aug-2009; ComponentLink2Description: Datasheet; ComponentLink1Description: Manufacturer URL; DatasheetVersion: revB, Sep-2011; ComponentLink3Description: Package Specification
U8 = Amplifier: PAM8302AADCR MEOW

## Nets that join several sheets
+5: Microcontroller_schematic (17 pins), Motors_and_Servos (10 pins), CAN (5 pins), LEDs (13 pins), Sensors (J16.2 J17.2 J18.2), Meow (8 pins)
+24: Microcontroller_schematic (+24.1 J11.2 VR1.3), Motors_and_Servos (9 pins), LEDs (R32.2)
GND: Microcontroller_schematic (23 pins), Motors_and_Servos (36 pins), CAN (9 pins), LEDs (11 pins), Sensors (J16.1 J17.1 J18.1), Meow (9 pins)
AMP_SD_n: Microcontroller_schematic (U1.29), Meow (U8.1)
BUS_SCL: Microcontroller_schematic (U1.25), Motors_and_Servos (R24.1 U2.26), Sensors (J18.3), Meow (SCL.1 U7.5)
BUS_SDA: Microcontroller_schematic (U1.26), Motors_and_Servos (R25.1 U2.27), Sensors (J18.4), Meow (SDA.1 U7.4)
CAN_addr_1: Microcontroller_schematic (U1.47), CAN (R14.1)
CAN_addr_2: Microcontroller_schematic (U1.46), CAN (R15.1)
CAN_addr_3: Microcontroller_schematic (U1.45), CAN (R16.1)
CAN_addr_4: Microcontroller_schematic (U1.44), CAN (R17.1)
CAN_LED: Microcontroller_schematic (U1.16), LEDs (R33.2)
CAN_RX: Microcontroller_schematic (U1.31), CAN (CAN_RX.1 U3.4)
CAN_TX: Microcontroller_schematic (U1.30), CAN (CAN_TX.1 U3.1)
DGB_LED: Microcontroller_schematic (U1.17), LEDs (R30.2)
DIR_1: Microcontroller_schematic (U1.13), Motors_and_Servos (DIR1.1 PWM1.13)
DIR_2: Microcontroller_schematic (U1.14), Motors_and_Servos (DIR2.1 PWM2.13)
DIR_3: Microcontroller_schematic (U1.15), Motors_and_Servos (DIR3.1 PWM3.13)
ENC_1_A: Microcontroller_schematic (U1.8), Motors_and_Servos (R9.1)
ENC_1_B: Microcontroller_schematic (U1.9), Motors_and_Servos (R8.1)
ENC_1_Z: Microcontroller_schematic (U1.50), Motors_and_Servos (R7.1)
ENC_2_A: Microcontroller_schematic (U1.27), Motors_and_Servos (R6.1)
ENC_2_B: Microcontroller_schematic (U1.28), Motors_and_Servos (R5.1)
ENC_2_Z: Microcontroller_schematic (U1.51), Motors_and_Servos (R4.1)
ERR_LED: Microcontroller_schematic (U1.18), LEDs (R29.2)
GAS_a: Microcontroller_schematic (U1.59), Sensors (J17.3)
Limit_SW_1: Microcontroller_schematic (U1.41), Motors_and_Servos (LIM1.1 R10.1)
Limit_SW_2: Microcontroller_schematic (U1.40), Motors_and_Servos (LIM2.1 R11.1)
Motor_FLT_1: Microcontroller_schematic (U1.12), Motors_and_Servos (PWM1.10), LEDs (FLT1.1 R21.2)
Motor_FLT_2: Microcontroller_schematic (U1.11), Motors_and_Servos (PWM2.10), LEDs (FLT2.1 R22.2)
Motor_FLT_3: Microcontroller_schematic (U1.10), Motors_and_Servos (PWM3.10), LEDs (FLT3.1 R23.2)
Motor_PWM_1: Microcontroller_schematic (U1.5), Motors_and_Servos (PWM1.12 PWM_1.1)
Motor_PWM_2: Microcontroller_schematic (U1.6), Motors_and_Servos (PWM2.12 PWM_2.1)
Motor_PWM_3: Microcontroller_schematic (U1.7), Motors_and_Servos (PWM3.12 PWM_3.1)
RGB_array: Microcontroller_schematic (U1.19), LEDs (R26.1 RGB.1)
Soil_a: Microcontroller_schematic (U1.58), Sensors (J16.3)